# Altium schematic sheet Sheet1.SchDoc
size 762 x 381 mm
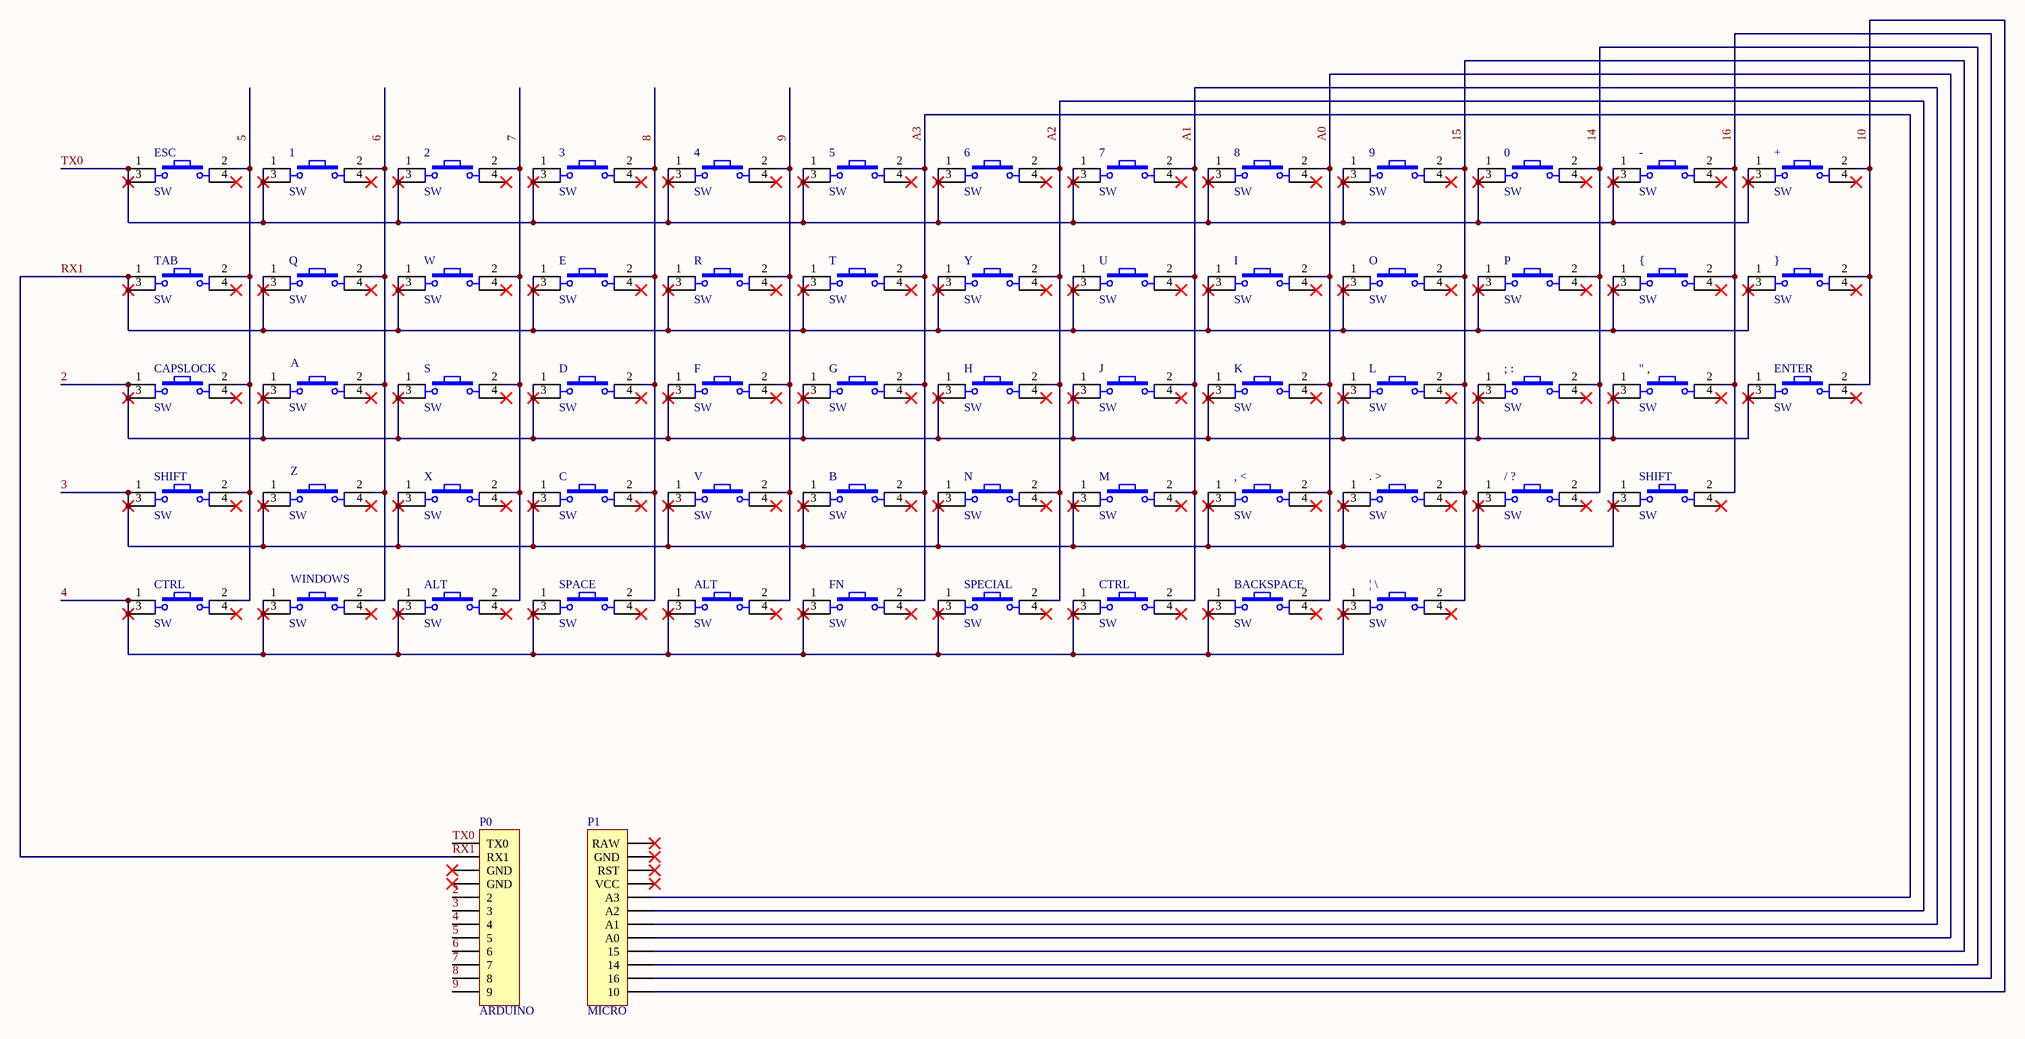
[diagram p0: Sheet1.SchDoc]

## Parts
(Parts that share a designator on the sheet are numbered #1, #2 ... from top to bottom, then left to right.)
0  SW  [SW4]
1  SW  [SW4]
2  SW  [SW4]
3  SW  [SW4]
4  SW  [SW4]
5  SW  [SW4]
6  SW  [SW4]
7  SW  [SW4]
8  SW  [SW4]
9  SW  [SW4]
"_,  SW  [SW4]
+  SW  [SW4]
,_<  SW  [SW4]
-  SW  [SW4]
._>  SW  [SW4]
/_?  SW  [SW4]
;_:  SW  [SW4]
A  SW  [SW4]
ALT#1  SW  [SW4]
ALT#2  SW  [SW4]
B  SW  [SW4]
BACKSPACE  SW  [SW4]
C  SW  [SW4]
CAPSLOCK  SW  [SW4]
CTRL#1  SW  [SW4]
CTRL#2  SW  [SW4]
D  SW  [SW4]
E  SW  [SW4]
ENTER  SW  [SW4]
ESC  SW  [SW4]
F  SW  [SW4]
FN  SW  [SW4]
G  SW  [SW4]
H  SW  [SW4]
I  SW  [SW4]
J  SW  [SW4]
K  SW  [SW4]
L  SW  [SW4]
M  SW  [SW4]
N  SW  [SW4]
O  SW  [SW4]
P  SW  [SW4]
P0  ARDUINO  [HDR1X12]
P1  MICRO  [HDR1X12]
Q  SW  [SW4]
R  SW  [SW4]
S  SW  [SW4]
SHIFT#1  SW  [SW4]
SHIFT#2  SW  [SW4]
SPACE  SW  [SW4]
SPECIAL  SW  [SW4]
T  SW  [SW4]
TAB  SW  [SW4]
U  SW  [SW4]
V  SW  [SW4]
W  SW  [SW4]
WINDOWS  SW  [SW4]
X  SW  [SW4]
Y  SW  [SW4]
Z  SW  [SW4]
{  SW  [SW4]
}  SW  [SW4]
|_\  SW  [SW4]

## Nets
2: "_,.1 "_,.3 ;_:.1 ;_:.3 A.1 A.3 CAPSLOCK.1 CAPSLOCK.3 D.1 D.3 ENTER.1 ENTER.3 F.1 F.3 G.1 G.3 H.1 H.3 J.1 J.3 K.1 K.3 L.1 L.3 P0.5(2) S.1 S.3
3: ,_<.1 ,_<.3 ._>.1 ._>.3 /_?.1 /_?.3 B.1 B.3 C.1 C.3 M.1 M.3 N.1 N.3 P0.6(3) SHIFT#1.1 SHIFT#1.3 SHIFT#2.1 SHIFT#2.3 V.1 V.3 X.1 X.3 Z.1 Z.3
4: ALT#1.1 ALT#1.3 ALT#2.1 ALT#2.3 BACKSPACE.1 BACKSPACE.3 CTRL#1.1 CTRL#1.3 CTRL#2.1 CTRL#2.3 FN.1 FN.3 P0.7(4) SPACE.1 SPACE.3 SPECIAL.1 SPECIAL.3 WINDOWS.1 WINDOWS.3 |_\.1 |_\.3
5: CAPSLOCK.2 CTRL#1.2 ESC.2 P0.8(5) SHIFT#1.2 TAB.2
6: 1.2 A.2 P0.9(6) Q.2 WINDOWS.2 Z.2
7: 2.2 ALT#1.2 P0.10(7) S.2 W.2 X.2
8: 3.2 C.2 D.2 E.2 P0.11(8) SPACE.2
9: 4.2 ALT#2.2 F.2 P0.12(9) R.2 V.2
10: +.2 ENTER.2 P1.1(10) }.2
14: 0.2 /_?.2 ;_:.2 P.2 P1.3(14)
15: 9.2 ._>.2 L.2 O.2 P1.4(15) |_\.2
16: "_,.2 -.2 P1.2(16) SHIFT#2.2 {.2
A0: 8.2 ,_<.2 BACKSPACE.2 I.2 K.2 P1.5(A0)
A1: 7.2 CTRL#2.2 J.2 M.2 P1.6(A1) U.2
A2: 6.2 H.2 N.2 P1.7(A2) SPECIAL.2 Y.2
A3: 5.2 B.2 FN.2 G.2 P1.8(A3) T.2
RX1: E.1 E.3 I.1 I.3 O.1 O.3 P.1 P.3 P0.2(RX1) Q.1 Q.3 R.1 R.3 T.1 T.3 TAB.1 TAB.3 U.1 U.3 W.1 W.3 Y.1 Y.3 {.1 {.3 }.1 }.3
TX0: 0.1 0.3 1.1 1.3 2.1 2.3 3.1 3.3 4.1 4.3 5.1 5.3 6.1 6.3 7.1 7.3 8.1 8.3 9.1 9.3 +.1 +.3 -.1 -.3 ESC.1 ESC.3 P0.1(TX0)

Not connected (* = marked no-connect by the designer): 0 4*; 1 4*; 2 4*; 3 4*; 4 4*; 5 4*; 6 4*; 7 4*; 8 4*; 9 4*; "_, 4*; + 4*; ,_< 4*; - 4*; ._> 4*; /_? 4*; ;_: 4*; A 4*; ALT#1 4*; ALT#2 4*; B 4*; BACKSPACE 4*; C 4*; CAPSLOCK 4*; CTRL#1 4*; CTRL#2 4*; D 4*; E 4*; ENTER 4*; ESC 4*; F 4*; FN 4*; G 4*; H 4*; I 4*; J 4*; K 4*; L 4*; M 4*; N 4*; O 4*; P 4*; P0 3(GND)* 4(GND)*; P1 9(VCC)* 10(RST)* 11(GND)* 12(RAW)*; Q 4*; R 4*; S 4*; SHIFT#1 4*; SHIFT#2 4*; SPACE 4*; SPECIAL 4*; T 4*; TAB 4*; U 4*; V 4*; W 4*; WINDOWS 4*; X 4*; Y 4*; Z 4*; { 4*; } 4*; |_\ 4*

## Library data of the parts
0-9 "_, + ,_< - ._> /_? ;_: A ALT#1 ALT#2 B BACKSPACE C CAPSLOCK CTRL#1 CTRL#2 D E ENTER ESC F FN G H I J K L M N O P Q R S SHIFT#1 SHIFT#2 SPACE SPECIAL T TAB U V W WINDOWS X Y Z { } |_\ = SW4: Switch button 4 pin; Value: Button chip 4 pin
P0 P1 = Header 12: Header, 12-Pin; LatestRevisionDate: 17-Jul-2002; LatestRevisionNote: Re-released for DXP Platform.; Publisher: Altium Limited